# Altium schematic sheet 33.SchDoc
size 594 x 420 mm; Scale: 1:1; Обозначение документа: ГУИР.203719.145 Э3; Номер листа: 27; Разраб.: Иванов; Пров.: Петров; Утв.: Сидоров; Наименование организации: ОАО "Концерн "МПО-Гидроприбор"; Наименование изделия 1: Плата; Наименование изделия 2: Схема электрическая; Наименование изделия 3: принципиальная; Нач. отд.: Нач. отд.; Фамилия нач. отд.: Сидоров
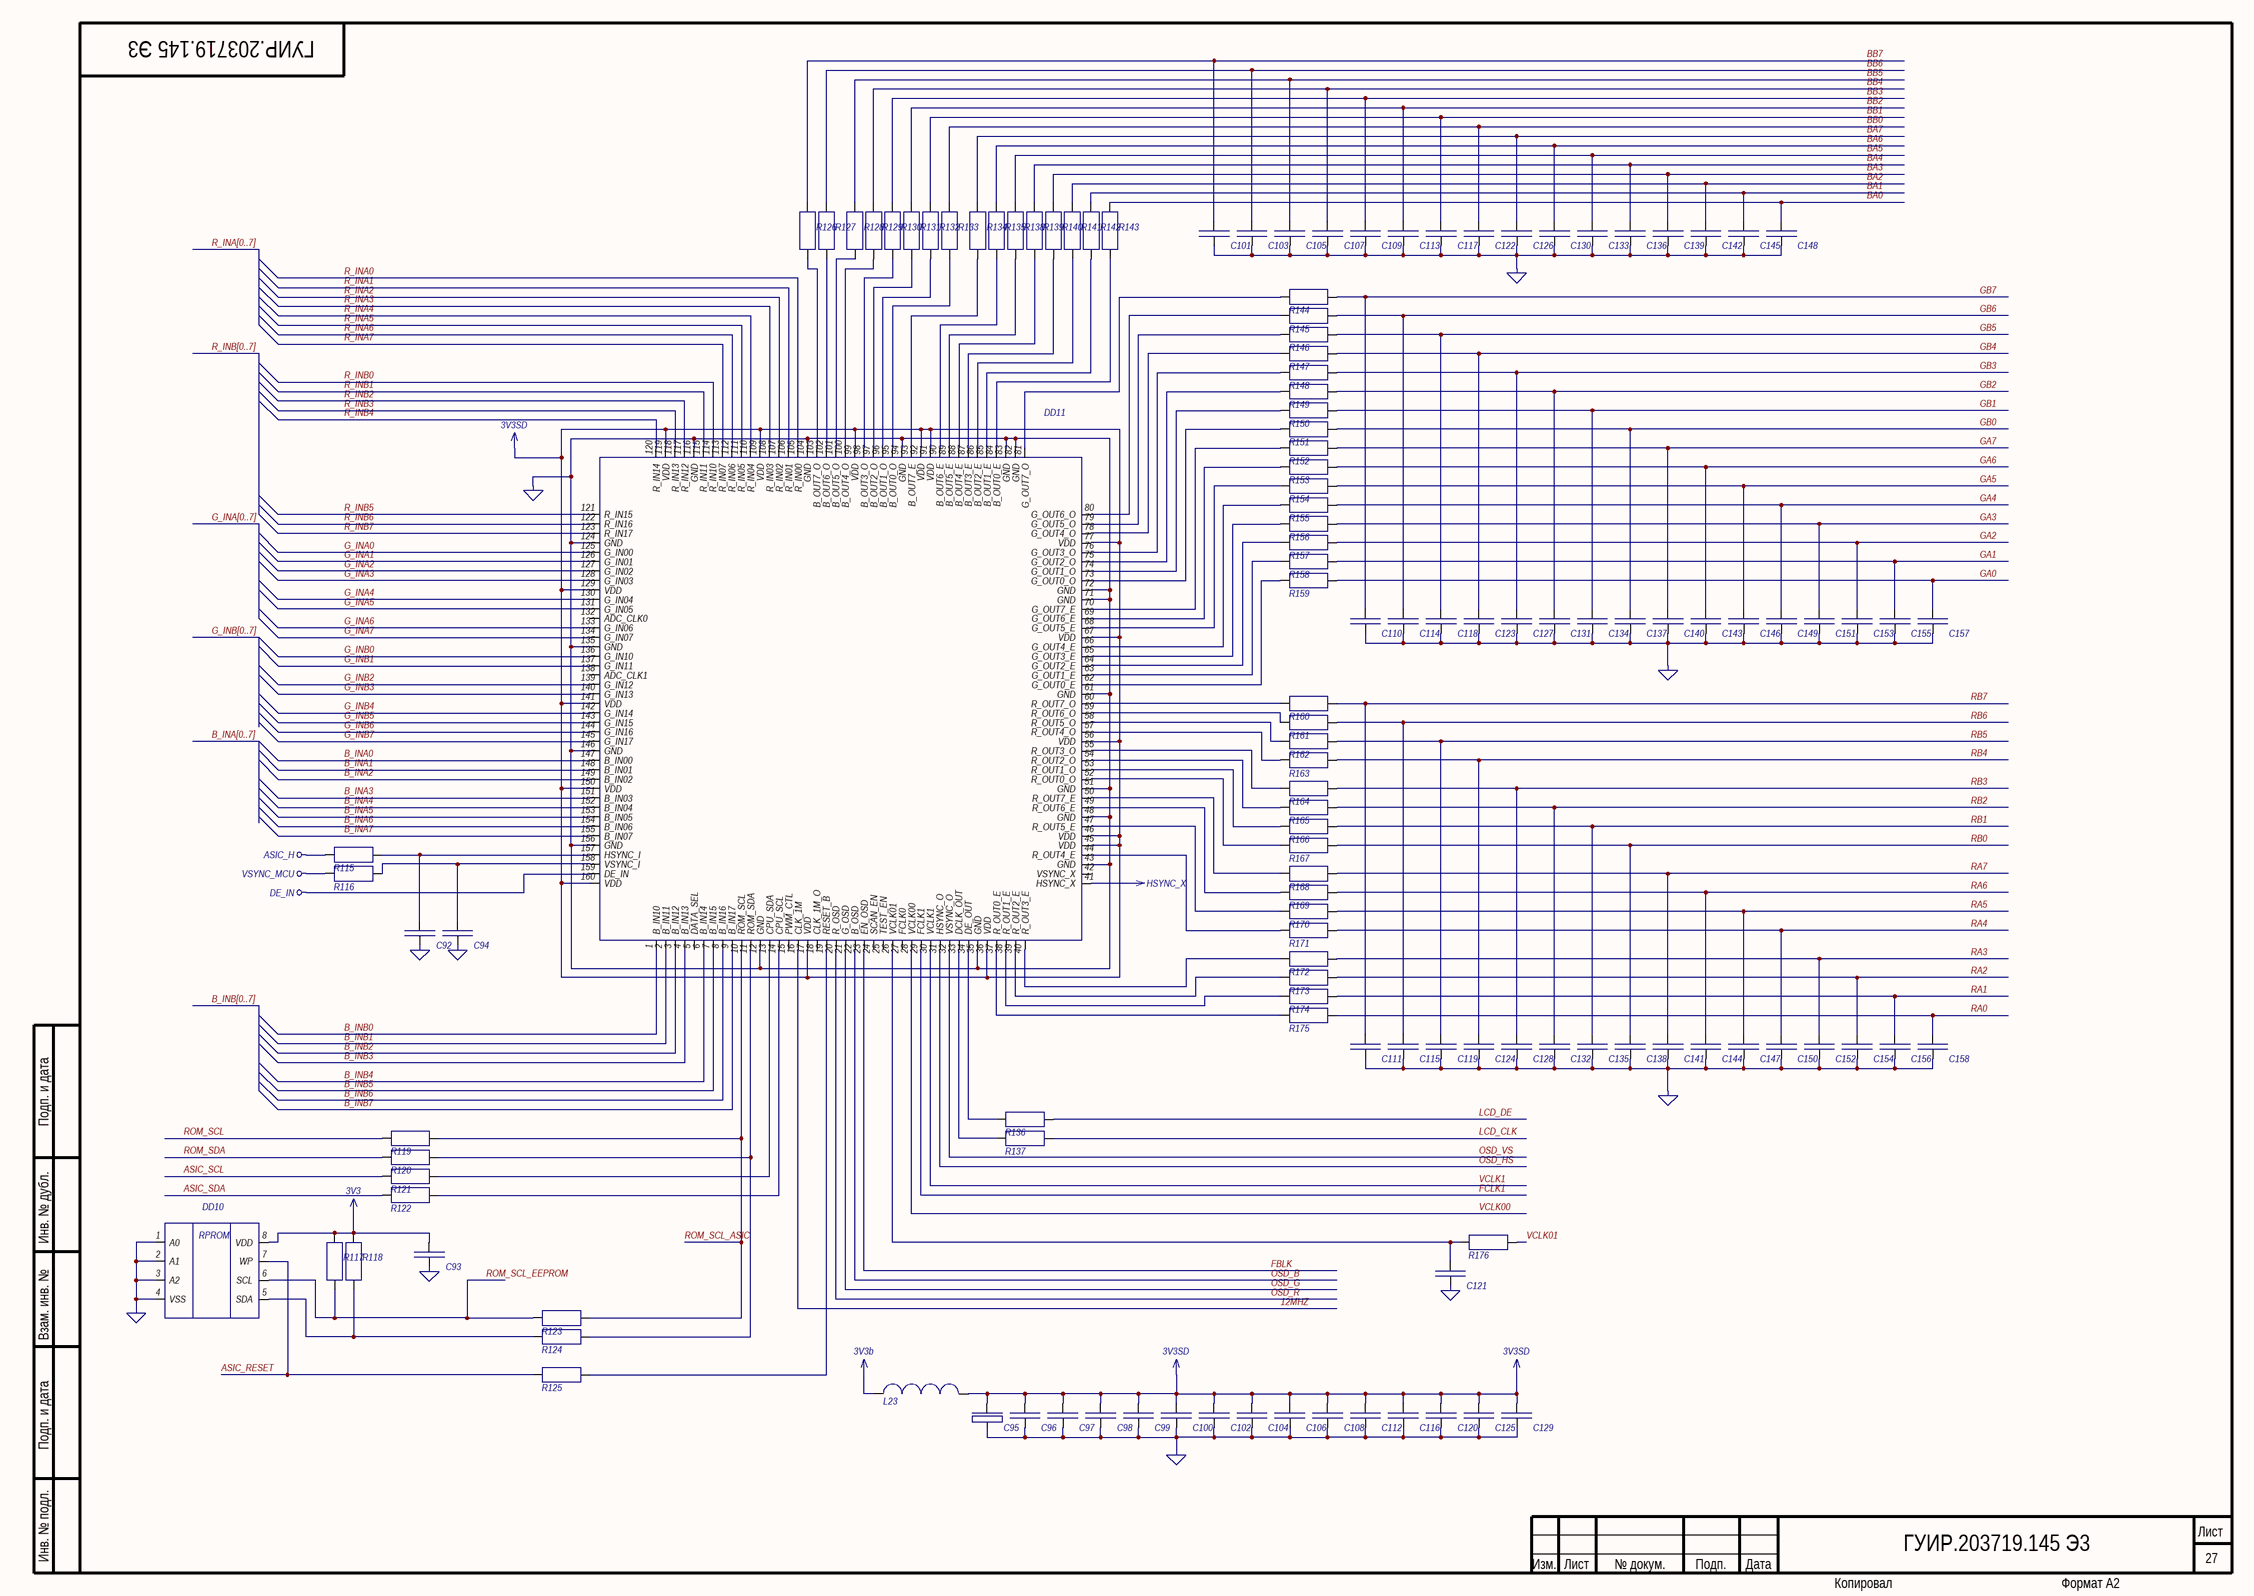
[diagram p0: 33.SchDoc]

## Parts
C92  Capacitor  [cap_electro_13]  (value not drawn)
C93  Capacitor  [cap_electro_13]  (value not drawn)
C94  Capacitor  [cap_electro_13]  (value not drawn)
C95  TuningCapacitor  [Cap_tantal_D]  (value not drawn)
C96  Capacitor  [cap_electro_13]  (value not drawn)
C97  Capacitor  [cap_electro_13]  (value not drawn)
C98  Capacitor  [cap_electro_13]  (value not drawn)
C99  Capacitor  [cap_electro_13]  (value not drawn)
C100  Capacitor  [cap_electro_13]  (value not drawn)
C101  Capacitor  [cap_electro_13]  (value not drawn)
C102  Capacitor  [cap_electro_13]  (value not drawn)
C103  Capacitor  [cap_electro_13]  (value not drawn)
C104  Capacitor  [cap_electro_13]  (value not drawn)
C105  Capacitor  [cap_electro_13]  (value not drawn)
C106  Capacitor  [cap_electro_13]  (value not drawn)
C107  Capacitor  [cap_electro_13]  (value not drawn)
C108  Capacitor  [cap_electro_13]  (value not drawn)
C109  Capacitor  [cap_electro_13]  (value not drawn)
C110  Capacitor  [cap_electro_13]  (value not drawn)
C111  Capacitor  [cap_electro_13]  (value not drawn)
C112  Capacitor  [cap_electro_13]  (value not drawn)
C113  Capacitor  [cap_electro_13]  (value not drawn)
C114  Capacitor  [cap_electro_13]  (value not drawn)
C115  Capacitor  [cap_electro_13]  (value not drawn)
C116  Capacitor  [cap_electro_13]  (value not drawn)
C117  Capacitor  [cap_electro_13]  (value not drawn)
C118  Capacitor  [cap_electro_13]  (value not drawn)
C119  Capacitor  [cap_electro_13]  (value not drawn)
C120  Capacitor  [cap_electro_13]  (value not drawn)
C121  Capacitor  [cap_electro_13]  (value not drawn)
C122  Capacitor  [cap_electro_13]  (value not drawn)
C123  Capacitor  [cap_electro_13]  (value not drawn)
C124  Capacitor  [cap_electro_13]  (value not drawn)
C125  Capacitor  [cap_electro_13]  (value not drawn)
C126  Capacitor  [cap_electro_13]  (value not drawn)
C127  Capacitor  [cap_electro_13]  (value not drawn)
C128  Capacitor  [cap_electro_13]  (value not drawn)
C129  Capacitor  [cap_electro_13]  (value not drawn)
C130  Capacitor  [cap_electro_13]  (value not drawn)
C131  Capacitor  [cap_electro_13]  (value not drawn)
C132  Capacitor  [cap_electro_13]  (value not drawn)
C133  Capacitor  [cap_electro_13]  (value not drawn)
C134  Capacitor  [cap_electro_13]  (value not drawn)
C135  Capacitor  [cap_electro_13]  (value not drawn)
C136  Capacitor  [cap_electro_13]  (value not drawn)
C137  Capacitor  [cap_electro_13]  (value not drawn)
C138  Capacitor  [cap_electro_13]  (value not drawn)
C139  Capacitor  [cap_electro_13]  (value not drawn)
C140  Capacitor  [cap_electro_13]  (value not drawn)
C141  Capacitor  [cap_electro_13]  (value not drawn)
C142  Capacitor  [cap_electro_13]  (value not drawn)
C143  Capacitor  [cap_electro_13]  (value not drawn)
C144  Capacitor  [cap_electro_13]  (value not drawn)
C145  Capacitor  [cap_electro_13]  (value not drawn)
C146  Capacitor  [cap_electro_13]  (value not drawn)
C147  Capacitor  [cap_electro_13]  (value not drawn)
C148  Capacitor  [cap_electro_13]  (value not drawn)
C149  Capacitor  [cap_electro_13]  (value not drawn)
C150  Capacitor  [cap_electro_13]  (value not drawn)
C151  Capacitor  [cap_electro_13]  (value not drawn)
C152  Capacitor  [cap_electro_13]  (value not drawn)
C153  Capacitor  [cap_electro_13]  (value not drawn)
C154  Capacitor  [cap_electro_13]  (value not drawn)
C155  Capacitor  [cap_electro_13]  (value not drawn)
C156  Capacitor  [cap_electro_13]  (value not drawn)
C157  Capacitor  [cap_electro_13]  (value not drawn)
C158  Capacitor  [cap_electro_13]  (value not drawn)
DD10  24LC08  [24Cxx]  (value not drawn)
DD11  SD1210  [SD1210]  (value not drawn)
L23  Inductor  [inductor]  (value not drawn)
R115  Resistor  [R_1206]  (value not drawn)
R116  Resistor  [R_1206]  (value not drawn)
R117  Resistor  [R_1206]  (value not drawn)
R118  Resistor  [R_1206]  (value not drawn)
R119  Resistor  [R_1206]  (value not drawn)
R120  Resistor  [R_1206]  (value not drawn)
R121  Resistor  [R_1206]  (value not drawn)
R122  Resistor  [R_1206]  (value not drawn)
R123  Resistor  [R_1206]  (value not drawn)
R124  Resistor  [R_1206]  (value not drawn)
R125  Resistor  [R_1206]  (value not drawn)
R126  Resistor  [R_1206]  (value not drawn)
R127  Resistor  [R_1206]  (value not drawn)
R128  Resistor  [R_1206]  (value not drawn)
R129  Resistor  [R_1206]  (value not drawn)
R130  Resistor  [R_1206]  (value not drawn)
R131  Resistor  [R_1206]  (value not drawn)
R132  Resistor  [R_1206]  (value not drawn)
R133  Resistor  [R_1206]  (value not drawn)
R134  Resistor  [R_1206]  (value not drawn)
R135  Resistor  [R_1206]  (value not drawn)
R136  Resistor  [R_1206]  (value not drawn)
R137  Resistor  [R_1206]  (value not drawn)
R138  Resistor  [R_1206]  (value not drawn)
R139  Resistor  [R_1206]  (value not drawn)
R140  Resistor  [R_1206]  (value not drawn)
R141  Resistor  [R_1206]  (value not drawn)
R142  Resistor  [R_1206]  (value not drawn)
R143  Resistor  [R_1206]  (value not drawn)
R144  Resistor  [R_1206]  (value not drawn)
R145  Resistor  [R_1206]  (value not drawn)
R146  Resistor  [R_1206]  (value not drawn)
R147  Resistor  [R_1206]  (value not drawn)
R148  Resistor  [R_1206]  (value not drawn)
R149  Resistor  [R_1206]  (value not drawn)
R150  Resistor  [R_1206]  (value not drawn)
R151  Resistor  [R_1206]  (value not drawn)
R152  Resistor  [R_1206]  (value not drawn)
R153  Resistor  [R_1206]  (value not drawn)
R154  Resistor  [R_1206]  (value not drawn)
R155  Resistor  [R_1206]  (value not drawn)
R156  Resistor  [R_1206]  (value not drawn)
R157  Resistor  [R_1206]  (value not drawn)
R158  Resistor  [R_1206]  (value not drawn)
R159  Resistor  [R_1206]  (value not drawn)
R160  Resistor  [R_1206]  (value not drawn)
R161  Resistor  [R_1206]  (value not drawn)
R162  Resistor  [R_1206]  (value not drawn)
R163  Resistor  [R_1206]  (value not drawn)
R164  Resistor  [R_1206]  (value not drawn)
R165  Resistor  [R_1206]  (value not drawn)
R166  Resistor  [R_1206]  (value not drawn)
R167  Resistor  [R_1206]  (value not drawn)
R168  Resistor  [R_1206]  (value not drawn)
R169  Resistor  [R_1206]  (value not drawn)
R170  Resistor  [R_1206]  (value not drawn)
R171  Resistor  [R_1206]  (value not drawn)
R172  Resistor  [R_1206]  (value not drawn)
R173  Resistor  [R_1206]  (value not drawn)
R174  Resistor  [R_1206]  (value not drawn)
R175  Resistor  [R_1206]  (value not drawn)
R176  Resistor  [R_1206]  (value not drawn)

## Nets
3V3: C93.2 DD10.8(VDD) R117.1 R118.1
3V3b: L23.1
3V3SD: C95.1 C96.2 C97.2 C98.2 C99.2 C100.2 C102.2 C104.2 C106.2 C108.2 C112.2 C116.2 C120.2 C125.2 C129.2 DD11.17(VDD) DD11.36(VDD) DD11.45(VDD) DD11.46(VDD) DD11.56(VDD) DD11.67(VDD) DD11.77(VDD) DD11.91(VDD) DD11.92(VDD) DD11.99(VDD) DD11.109(VDD) DD11.119(VDD) DD11.129(VDD) DD11.141(VDD) DD11.150(VDD) DD11.160(VDD) L23.2
ASIC_H: R115.2
DE_IN: DD11.159(DE_IN)
GND: C92.1 C93.1 C94.1 C95.2 C96.1 C97.1 C98.1 C99.1 C100.1 C101.1 C102.1 C103.1 C104.1 C105.1 C106.1 C107.1 C108.1 C109.1 C110.1 C111.1 C112.1 C113.1 C114.1 C115.1 C116.1 C117.1 C118.1 C119.1 C120.1 C121.1 C122.1 C123.1 C124.1 C125.1 C126.1 C127.1 C128.1 C129.1 C130.1 C131.1 C132.1 C133.1 C134.1 C135.1 C136.1 C137.1 C138.1 C139.1 C140.1 C141.1 C142.1 C143.1 C144.1 C145.1 C146.1 C147.1 C148.1 C149.1 C150.1 C151.1 C152.1 C153.1 C154.1 C155.1 C156.1 C157.1 C158.1 DD10.1(A0) DD10.2(A1) DD10.3(A2) DD10.4(VSS) DD11.12(GND) DD11.35(GND) DD11.43(GND) DD11.48(GND) DD11.51(GND) DD11.61(GND) DD11.71(GND) DD11.72(GND) DD11.82(GND) DD11.83(GND) DD11.94(GND) DD11.104(GND) DD11.116(GND) DD11.124(GND) DD11.135(GND) DD11.146(GND) DD11.156(GND)
HSYNC_X: DD11.41(HSYNC_X)
VSYNC_MCU: R116.2
12MHZ: DD11.16(CLK_1M)
ASIC_RESET: DD10.7(WP) R125.2
ASIC_SCL: R121.2
ASIC_SDA: R122.2
B_INA0: DD11.147(B_IN00)
B_INA1: DD11.148(B_IN01)
B_INA2: DD11.149(B_IN02)
B_INA3: DD11.151(B_IN03)
B_INA4: DD11.152(B_IN04)
B_INA5: DD11.153(B_IN05)
B_INA6: DD11.154(B_IN06)
B_INA7: DD11.155(B_IN07)
B_INB0: DD11.1(B_IN10)
B_INB1: DD11.2(B_IN11)
B_INB2: DD11.3(B_IN12)
B_INB3: DD11.4(B_IN13)
B_INB4: DD11.6(B_IN14)
B_INB5: DD11.7(B_IN15)
B_INB6: DD11.8(B_IN16)
B_INB7: DD11.9(B_IN17)
BA0: C148.2 R143.1
BA1: C145.2 R142.1
BA2: C142.2 R141.1
BA3: C139.2 R140.1
BA4: C136.2 R139.1
BA5: C133.2 R138.1
BA6: C130.2 R135.1
BA7: C126.2 R134.1
BB0: C122.2 R133.1
BB1: C117.2 R132.1
BB2: C113.2 R131.1
BB3: C109.2 R130.1
BB4: C107.2 R129.1
BB5: C105.2 R128.1
BB6: C103.2 R127.1
BB7: C101.2 R126.1
FBLK: DD11.23(EN_OSD)
FCLK1: DD11.29(FCLK1)
G_INA0: DD11.125(G_IN00)
G_INA1: DD11.126(G_IN01)
G_INA2: DD11.127(G_IN02)
G_INA3: DD11.128(G_IN03)
G_INA4: DD11.130(G_IN04)
G_INA5: DD11.131(G_IN05)
G_INA6: DD11.133(G_IN06)
G_INA7: DD11.134(G_IN07)
G_INB0: DD11.136(G_IN10)
G_INB1: DD11.137(G_IN11)
G_INB2: DD11.139(G_IN12)
G_INB3: DD11.140(G_IN13)
G_INB4: DD11.142(G_IN14)
G_INB5: DD11.143(G_IN15)
G_INB6: DD11.144(G_IN16)
G_INB7: DD11.145(G_IN17)
GA0: C157.2 R159.1
GA1: C155.2 R158.1
GA2: C153.2 R157.1
GA3: C151.2 R156.1
GA4: C149.2 R155.1
GA5: C146.2 R154.1
GA6: C143.2 R153.1
GA7: C140.2 R152.1
GB0: C137.2 R151.1
GB1: C134.2 R150.1
GB2: C131.2 R149.1
GB3: C127.2 R148.1
GB4: C123.2 R147.1
GB5: C118.2 R146.1
GB6: C114.2 R145.1
GB7: C110.2 R144.1
LCD_CLK: R137.1
LCD_DE: R136.1
OSD_B: DD11.22(B_OSD)
OSD_G: DD11.21(G_OSD)
OSD_HS: DD11.31(HSYNC_O)
OSD_R: DD11.20(R_OSD)
OSD_VS: DD11.32(VSYNC_O)
R_INA0: DD11.105(R_IN00)
R_INA1: DD11.106(R_IN01)
R_INA2: DD11.107(R_IN02)
R_INA3: DD11.108(R_IN03)
R_INA4: DD11.110(R_IN04)
R_INA5: DD11.111(R_IN05)
R_INA6: DD11.112(R_IN06)
R_INA7: DD11.113(R_IN07)
R_INB0: DD11.114(R_IN10)
R_INB1: DD11.115(R_IN11)
R_INB2: DD11.117(R_IN12)
R_INB3: DD11.118(R_IN13)
R_INB4: DD11.120(R_IN14)
R_INB5: DD11.121(R_IN15)
R_INB6: DD11.122(R_IN16)
R_INB7: DD11.123(R_IN17)
RA0: C158.2 R175.1
RA1: C156.2 R174.1
RA2: C154.2 R173.1
RA3: C152.2 R172.1
RA4: C150.2 R171.1
RA5: C147.2 R170.1
RA6: C144.2 R169.1
RA7: C141.2 R168.1
RB0: C138.2 R167.1
RB1: C135.2 R166.1
RB2: C132.2 R165.1
RB3: C128.2 R164.1
RB4: C124.2 R163.1
RB5: C119.2 R162.1
RB6: C115.2 R161.1
RB7: C111.2 R160.1
ROM_SCL: R119.2
ROM_SCL_ASIC: DD11.10(ROM_SCL) R119.1 R123.1
ROM_SCL_EEPROM: DD10.6(SCL) R117.2 R123.2
ROM_SDA: R120.2
VCLK00: DD11.28(VCLK00)
VCLK01: R176.1
VCLK1: DD11.30(VCLK1)
NetC92_2: C92.2 DD11.157(HSYNC_I) R115.1
NetC94_2: C94.2 DD11.158(VSYNC_I) R116.1
NetC121_2: C121.2 DD11.26(VCLK01) R176.2
NetDD10_5: DD10.5(SDA) R118.2 R124.2
NetDD11_11: DD11.11(ROM_SDA) R120.1 R124.1
NetDD11_13: DD11.13(CPU_SDA) R121.1
NetDD11_14: DD11.14(CPU_SCL) R122.1
NetDD11_19: DD11.19(RESET_B) R125.1
NetDD11_33: DD11.33(DCLK_OUT) R137.2
NetDD11_34: DD11.34(DE_OUT) R136.2
NetDD11_37: DD11.37(R_OUT0_E) R175.2
NetDD11_38: DD11.38(R_OUT1_E) R174.2
NetDD11_39: DD11.39(R_OUT2_E) R173.2
NetDD11_40: DD11.40(R_OUT3_E) R172.2
NetDD11_44: DD11.44(R_OUT4_E) R171.2
NetDD11_47: DD11.47(R_OUT5_E) R170.2
NetDD11_49: DD11.49(R_OUT6_E) R169.2
NetDD11_50: DD11.50(R_OUT7_E) R168.2
NetDD11_52: DD11.52(R_OUT0_O) R167.2
NetDD11_53: DD11.53(R_OUT1_O) R166.2
NetDD11_54: DD11.54(R_OUT2_O) R165.2
NetDD11_55: DD11.55(R_OUT3_O) R164.2
NetDD11_57: DD11.57(R_OUT4_O) R163.2
NetDD11_58: DD11.58(R_OUT5_O) R162.2
NetDD11_59: DD11.59(R_OUT6_O) R161.2
NetDD11_60: DD11.60(R_OUT7_O) R160.2
NetDD11_62: DD11.62(G_OUT0_E) R159.2
NetDD11_63: DD11.63(G_OUT1_E) R158.2
NetDD11_64: DD11.64(G_OUT2_E) R157.2
NetDD11_65: DD11.65(G_OUT3_E) R156.2
NetDD11_66: DD11.66(G_OUT4_E) R155.2
NetDD11_68: DD11.68(G_OUT5_E) R154.2
NetDD11_69: DD11.69(G_OUT6_E) R153.2
NetDD11_70: DD11.70(G_OUT7_E) R152.2
NetDD11_73: DD11.73(G_OUT0_O) R151.2
NetDD11_74: DD11.74(G_OUT1_O) R150.2
NetDD11_75: DD11.75(G_OUT2_O) R149.2
NetDD11_76: DD11.76(G_OUT3_O) R148.2
NetDD11_78: DD11.78(G_OUT4_O) R147.2
NetDD11_79: DD11.79(G_OUT5_O) R146.2
NetDD11_80: DD11.80(G_OUT6_O) R145.2
NetDD11_81: DD11.81(G_OUT7_O) R144.2
NetDD11_84: DD11.84(B_OUT0_E) R143.2
NetDD11_85: DD11.85(B_OUT1_E) R142.2
NetDD11_86: DD11.86(B_OUT2_E) R141.2
NetDD11_87: DD11.87(B_OUT3_E) R140.2
NetDD11_88: DD11.88(B_OUT4_E) R139.2
NetDD11_89: DD11.89(B_OUT5_E) R138.2
NetDD11_90: DD11.90(B_OUT6_E) R135.2
NetDD11_93: DD11.93(B_OUT7_E) R134.2
NetDD11_95: DD11.95(B_OUT0_O) R133.2
NetDD11_96: DD11.96(B_OUT1_O) R132.2
NetDD11_97: DD11.97(B_OUT2_O) R131.2
NetDD11_98: DD11.98(B_OUT3_O) R130.2
NetDD11_100: DD11.100(B_OUT4_O) R129.2
NetDD11_101: DD11.101(B_OUT5_O) R128.2
NetDD11_102: DD11.102(B_OUT6_O) R127.2
NetDD11_103: DD11.103(B_OUT7_O) R126.2

Not connected (* = marked no-connect by the designer): DD11 5(DATA_SEL) 15(PWM_CTL) 18(CLK_1M_O) 24(SCAN_EN) 25(TEST_EN) 27(FCLK0) 42(VSYNC_X) 132(ADC_CLK0) 138(ADC_CLK1)

## Buses and harness runs
bus B_INA[0..7]
bus B_INB[0..7]
bus G_INA[0..7]
bus G_INB[0..7]
bus R_INA[0..7]
bus R_INB[0..7]

## Notes on the sheet
- Подп. и дата
- Инв. № дубл.
- Взам. инв. №
- Инв. № подл.
- Изм.
- Лист
- № докум.
- Подп.
- Дата
- Копировал
- Формат А2
- (in symbol 24LC08) RPROM